# Altium schematic sheet EVK-IRIS-W1-MUCLINK.SchDoc
size A3; DocumentNumber: 7; SheetNumber: 7; SheetTotal: 14
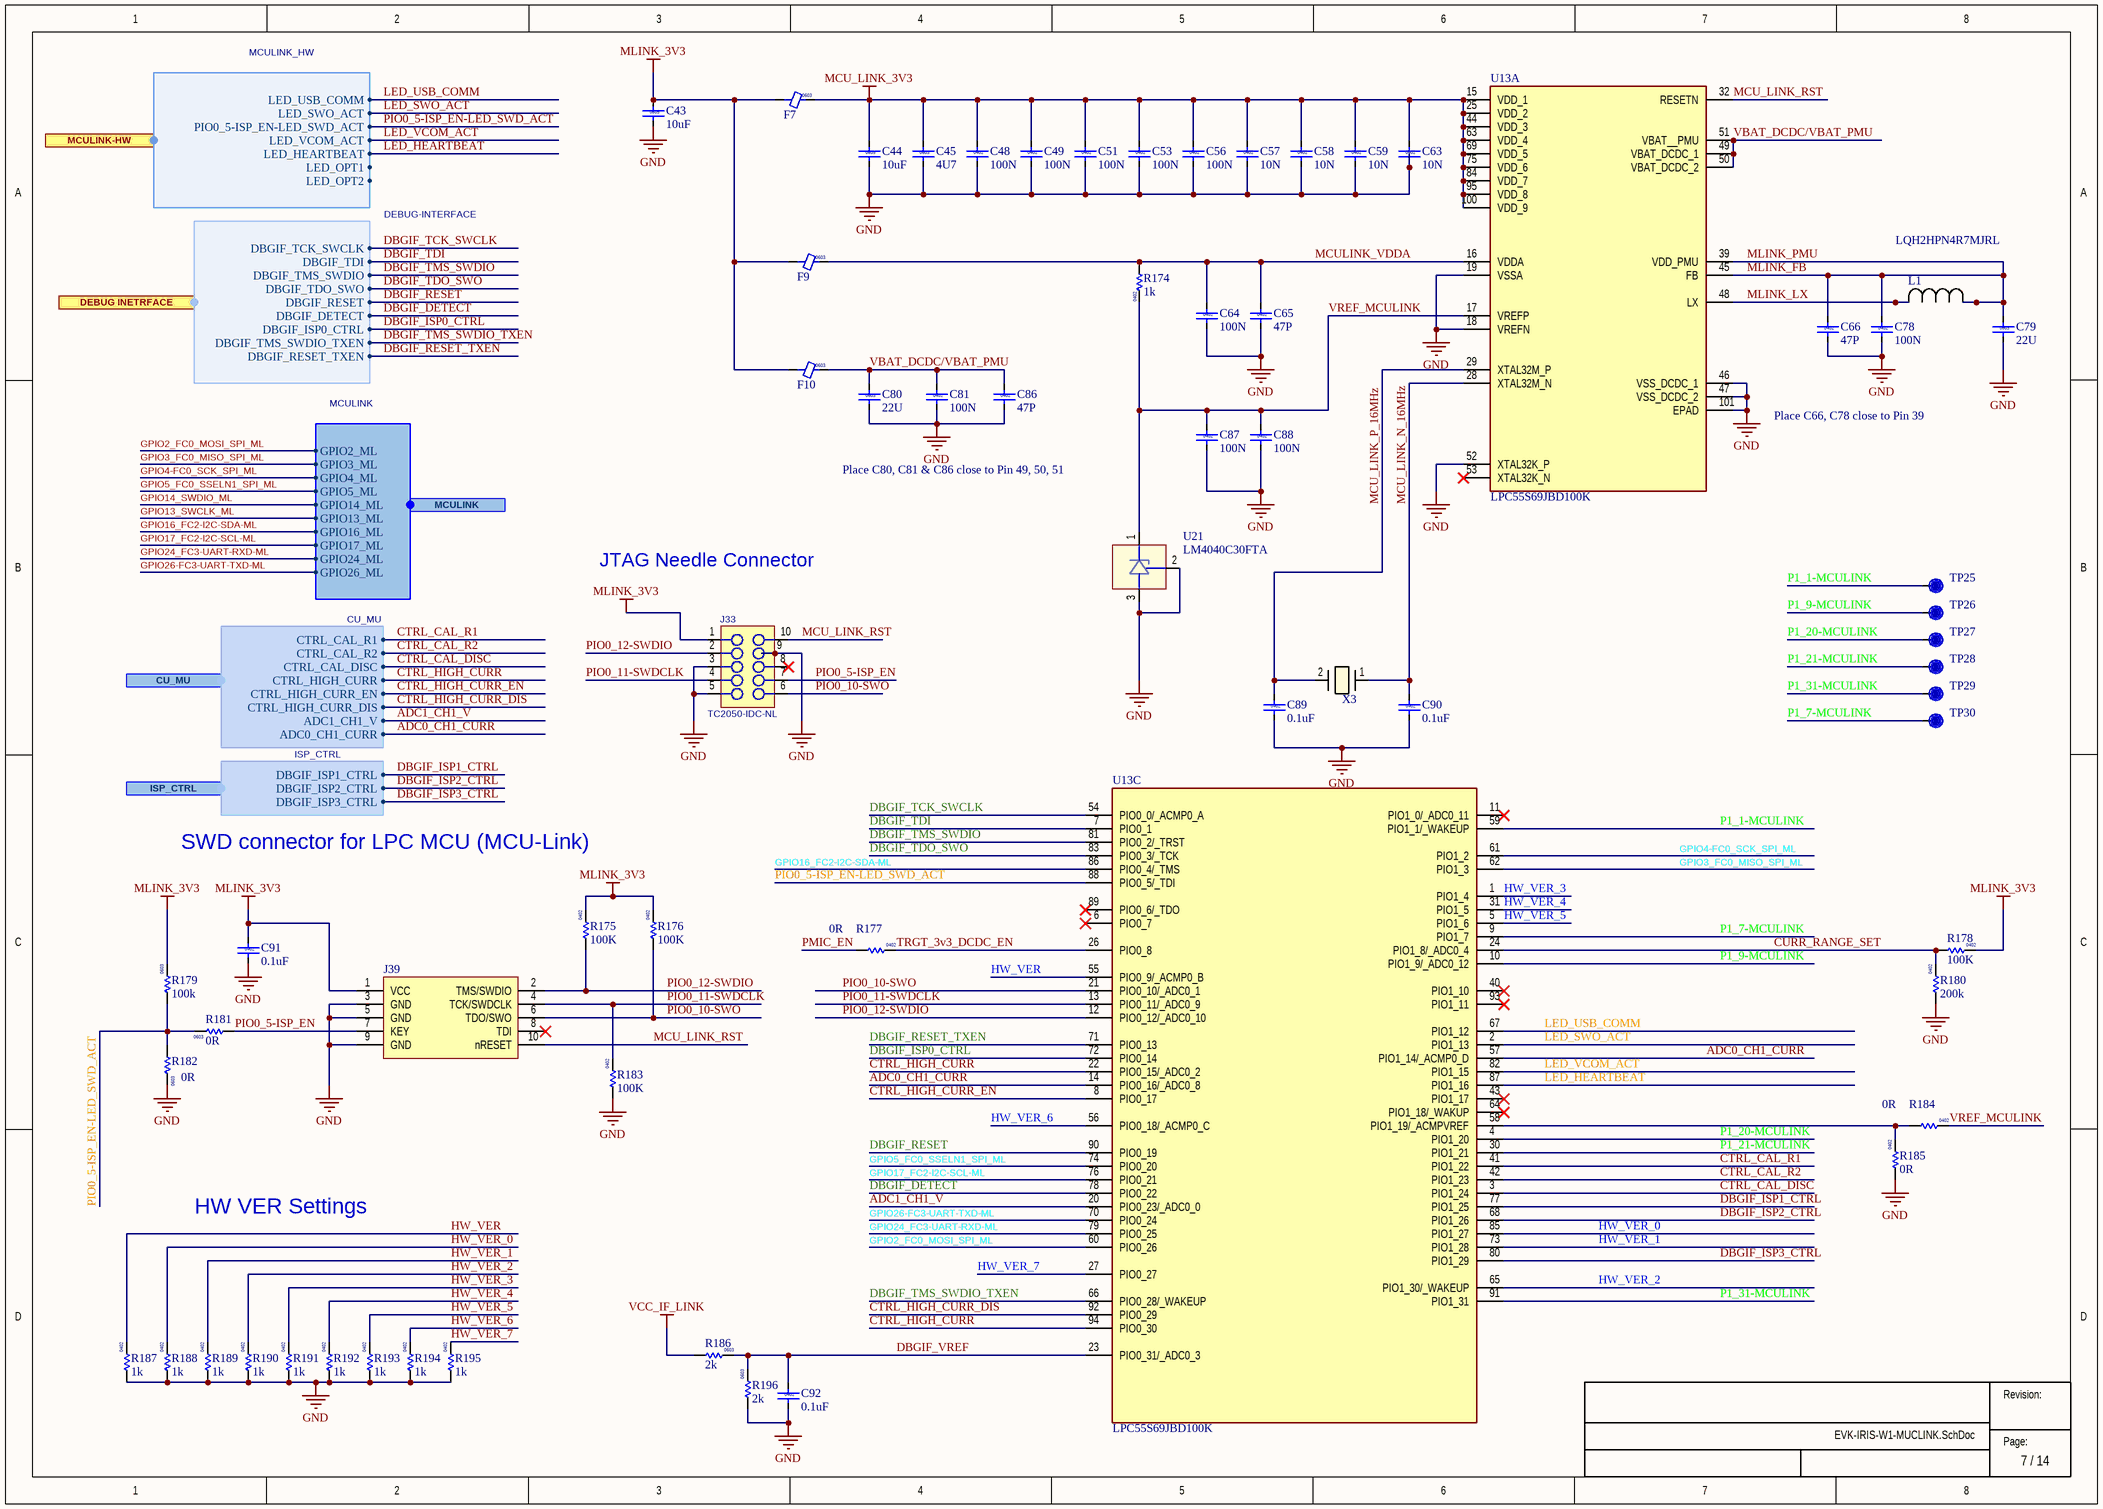
[diagram p0: EVK-IRIS-W1-MUCLINK.SchDoc]

## Parts
C43  value 10uF  Size: 0805  [Cap 0805 HD]
C44  value 10uF  Size: 0805  [Cap 0805 HD]
C45  value 4U7  Size: 0603  [Cap 0603 HD]
C48  value 100N  Size: 0402  [Cap_0402_1100Lx600Wx600H_600x600Pad_350G_FLX]
C49  value 100N  Size: 0402  [Cap_0402_1100Lx600Wx600H_600x600Pad_350G_FLX]
C51  value 100N  Size: 0402  [Cap_0402_1100Lx600Wx600H_600x600Pad_350G_FLX]
C53  value 100N  Size: 0402  [Cap_0402_1100Lx600Wx600H_600x600Pad_350G_FLX]
C56  value 100N  Size: 0402  [Cap_0402_1100Lx600Wx600H_600x600Pad_350G_FLX]
C57  value 10N  Size: 0402  [Cap_0402_1100Lx600Wx600H_600x600Pad_350G_FLX]
C58  value 10N  Size: 0402  [Cap_0402_1100Lx600Wx600H_600x600Pad_350G_FLX]
C59  value 10N  Size: 0402  [Cap_0402_1100Lx600Wx600H_600x600Pad_350G_FLX]
C63  value 10N  Size: 0402  [Cap_0402_1100Lx600Wx600H_600x600Pad_350G_FLX]
C64  value 100N  Size: 0402  [Cap_0402_1100Lx600Wx600H_600x600Pad_350G_FLX]
C65  value 47P  Size: 0402  [Cap_0402_1100Lx600Wx600H_600x600Pad_350G_FLX]
C66  value 47P  Size: 0402  [Cap_0402_1100Lx600Wx600H_600x600Pad_350G_FLX]
C78  value 100N  Size: 0402  [Cap_0402_1100Lx600Wx600H_600x600Pad_350G_FLX]
C79  value 22U  Size: 0603  [Cap 0603]
C80  value 22U  Size: 0603  [Cap 0603]
C81  value 100N  Size: 0402  [Cap_0402_1100Lx600Wx600H_600x600Pad_350G_FLX]
C86  value 47P  Size: 0402  [Cap_0402_1100Lx600Wx600H_600x600Pad_350G_FLX]
C87  value 100N  Size: 0402  [Cap_0402_1100Lx600Wx600H_600x600Pad_350G_FLX]
C88  value 100N  Size: 0402  [Cap_0402_1100Lx600Wx600H_600x600Pad_350G_FLX]
C89  value 0.1uF  Size: 0402  [Cap 0402 HD]
C90  value 0.1uF  Size: 0402  [Cap 0402 HD]
C91  value 0.1uF  Size: 0402  [Cap 0402 HD]
C92  value 0.1uF  Size: 0402  [Cap 0402 HD]
F7  Size: 0603  [IND 0603]
F9  Size: 0603  [IND 0603]
F10  Size: 0603  [IND 0603]
J33  TC2050-IDC-NLDNP  [TC2050-IDC-NL]  (value not drawn)  (no BOM)
J39  (no value)  [HDR.050P-10Pin-2x5-SMT_Key]
L1  LQH2HPN4R7MJRL  [IND_LQH2HPN4R7MJRL_MUR]
R174  value 1k  Size: 0402  [RES 0402 HD]
R175  value 100K  Size: 0402  [RES 0402 HD]
R176  value 100K  Size: 0402  [RES 0402 HD]
R177  value 0R  Size: 0402  [RES 0402 HD]
R178  value 100K  Size: 0402  [RES 0402 HD]
R179  value 100k  Size: 0603  [RES 0603 HD]
R180  value 200k  Size: 0402  [RES 0402 HD]
R181  value 0R  Size: 0603  [RES 0603 HD]
R182  value 0R  Size: 0603  [RES 0603 HD]
R183  value 100K  Size: 0402  [RES 0402 HD]
R184  value 0R  Size: 0402  [RES 0402 HD]
R185  value 0R  Size: 0402  [RES 0402 HD]
R186  value 2k  Size: 0603  [RES 0603 HD]
R187  value 1k  Size: 0402  [RES 0402 HD]
R188  value 1k  Size: 0402  [RES 0402 HD]
R189  value 1k  Size: 0402  [RES 0402 HD]
R190  value 1k  Size: 0402  [RES 0402 HD]
R191  value 1k  Size: 0402  [RES 0402 HD]
R192  value 1k  Size: 0402  [RES 0402 HD]
R193  value 1k  Size: 0402  [RES 0402 HD]
R194  value 1k  Size: 0402  [RES 0402 HD]
R195  value 1k  Size: 0402  [RES 0402 HD]
R196  value 2k  Size: 0603  [RES 0603 HD]
TP25  TP  [TP10R]  (value not drawn)
TP26  TP  [TP10R]  (value not drawn)
TP27  TP  [TP10R]  (value not drawn)
TP28  TP  [TP10R]  (value not drawn)
TP29  TP  [TP10R]  (value not drawn)
TP30  TP  [TP10R]  (value not drawn)
U13  LPC55S69JBD100K  [QFP50P1600X1600X160-101N]  (parts A,C of 3)
U21  LM4040C30FTA  [SOT-23]
X3  CX3225GA16000D0PTVCC  [xtal2_CX3225GA_AVX]  (value not drawn)

## Ports
CU_MU (harness CU_MU), DEBUG INETRFACE (harness DEBUG-INTERFACE), ISP_CTRL (harness ISP_CTRL), MCULINK (harness MCULINK), MCULINK-HW (harness MCULINK_HW)

## Harnesses
MCULINK_HW: LED_USB_COMM, LED_SWO_ACT, PIO0_5-ISP_EN-LED_SWD_ACT, LED_VCOM_ACT, LED_HEARTBEAT, LED_OPT1, LED_OPT2
DEBUG-INTERFACE: DBGIF_TCK_SWCLK, DBGIF_TDI, DBGIF_TMS_SWDIO, DBGIF_TDO_SWO, DBGIF_RESET, DBGIF_DETECT, DBGIF_ISP0_CTRL, DBGIF_TMS_SWDIO_TXEN, DBGIF_RESET_TXEN
CU_MU: CTRL_CAL_R1, CTRL_CAL_R2, CTRL_CAL_DISC, CTRL_HIGH_CURR, CTRL_HIGH_CURR_EN, CTRL_HIGH_CURR_DIS, ADC1_CH1_V, ADC0_CH1_CURR
ISP_CTRL: DBGIF_ISP1_CTRL, DBGIF_ISP2_CTRL, DBGIF_ISP3_CTRL
MCULINK: GPIO2_ML, GPIO3_ML, GPIO4_ML, GPIO5_ML, GPIO13_ML, GPIO14_ML, GPIO16_ML, GPIO17_ML, GPIO24_ML, GPIO26_ML

## Nets
GND: C43.2 C44.2 C45.2 C48.2 C49.2 C51.2 C53.2 C56.2 C57.2 C58.2 C59.2 C63.2 C64.2 C65.2 C66.2 C78.2 C79.2 C80.2 C81.2 C86.2 C87.2 C88.2 C89.2 C90.2 C91.2 C92.2 J33.3 J33.5 J33.9 J39.3(GND) J39.5(GND) J39.9(GND) R180.1 R182.2 R183.1 R185.1 R187.1 R188.1 R189.1 R190.1 R191.1 R192.1 R193.1 R194.1 R195.1 R196.1 U13.18(VREFN) U13.19(VSSA) U13.46(VSS_DCDC_1) U13.47(VSS_DCDC_2) U13.52(XTAL32K_P) U13.101(EPAD) U21.2(REF) U21.3(A)
MCU_LINK_3V3: C44.1 C45.1 C48.1 C49.1 C51.1 C53.1 C56.1 C57.1 C58.1 C59.1 C63.1 F7.2 U13.15(VDD_1) U13.25(VDD_2) U13.44(VDD_3) U13.63(VDD_4) U13.69(VDD_5) U13.75(VDD_6) U13.84(VDD_7) U13.95(VDD_8) U13.100(VDD_9)
MLINK_3V3: C43.1 C91.1 F7.1 F9.1 F10.1 J33.1 J39.1(VCC) R175.2 R176.2 R178.2 R179.2
VCC_IF_LINK: R186.1
ADC0_CH1_CURR: U13.14(PIO0_16/_ADC0_8) U13.57(PIO1_14/_ACMP0_D) ; port CU_MU.ADC0_CH1_CURR
ADC1_CH1_V: U13.20(PIO0_23/_ADC0_0) ; port CU_MU.ADC1_CH1_V
CTRL_CAL_DISC: U13.3(PIO1_24) ; port CU_MU.CTRL_CAL_DISC
CTRL_CAL_R1: U13.41(PIO1_22) ; port CU_MU.CTRL_CAL_R1
CTRL_CAL_R2: U13.42(PIO1_23) ; port CU_MU.CTRL_CAL_R2
CTRL_HIGH_CURR: U13.22(PIO0_15/_ADC0_2) U13.94(PIO0_30) ; port CU_MU.CTRL_HIGH_CURR
CTRL_HIGH_CURR_DIS: U13.92(PIO0_29) ; port CU_MU.CTRL_HIGH_CURR_DIS
CTRL_HIGH_CURR_EN: U13.8(PIO0_17) ; port CU_MU.CTRL_HIGH_CURR_EN
CURR_RANGE_SET: R178.1 R180.2 U13.24(PIO1_8/_ADC0_4)
DBGIF_DETECT: U13.78(PIO0_22) ; port DEBUG INETRFACE.DBGIF_DETECT
DBGIF_ISP0_CTRL: U13.72(PIO0_14) ; port DEBUG INETRFACE.DBGIF_ISP0_CTRL
DBGIF_ISP1_CTRL: U13.77(PIO1_25) ; port ISP_CTRL.DBGIF_ISP1_CTRL
DBGIF_ISP2_CTRL: U13.68(PIO1_26) ; port ISP_CTRL.DBGIF_ISP2_CTRL
DBGIF_ISP3_CTRL: U13.80(PIO1_29) ; port ISP_CTRL.DBGIF_ISP3_CTRL
DBGIF_RESET: U13.90(PIO0_19) ; port DEBUG INETRFACE.DBGIF_RESET
DBGIF_RESET_TXEN: U13.71(PIO0_13) ; port DEBUG INETRFACE.DBGIF_RESET_TXEN
DBGIF_TCK_SWCLK: U13.54(PIO0_0/_ACMP0_A) ; port DEBUG INETRFACE.DBGIF_TCK_SWCLK
DBGIF_TDI: U13.7(PIO0_1) ; port DEBUG INETRFACE.DBGIF_TDI
DBGIF_TDO_SWO: U13.83(PIO0_3/_TCK) ; port DEBUG INETRFACE.DBGIF_TDO_SWO
DBGIF_TMS_SWDIO: U13.81(PIO0_2/_TRST) ; port DEBUG INETRFACE.DBGIF_TMS_SWDIO
DBGIF_TMS_SWDIO_TXEN: U13.66(PIO0_28/_WAKEUP) ; port DEBUG INETRFACE.DBGIF_TMS_SWDIO_TXEN
DBGIF_VREF: C92.1 R186.2 R196.2 U13.23(PIO0_31/_ADC0_3)
GPIO2_FC0_MOSI_SPI_ML: U13.60(PIO0_26) ; port MCULINK.GPIO2_ML
GPIO3_FC0_MISO_SPI_ML: U13.62(PIO1_3) ; port MCULINK.GPIO3_ML
GPIO4-FC0_SCK_SPI_ML: U13.61(PIO1_2) ; port MCULINK.GPIO4_ML
GPIO5_FC0_SSELN1_SPI_ML: U13.74(PIO0_20) ; port MCULINK.GPIO5_ML
GPIO13_SWCLK_ML: port MCULINK.GPIO13_ML
GPIO14_SWDIO_ML: port MCULINK.GPIO14_ML
GPIO16_FC2-I2C-SDA-ML: U13.86(PIO0_4/_TMS) ; port MCULINK.GPIO16_ML
GPIO17_FC2-I2C-SCL-ML: U13.76(PIO0_21) ; port MCULINK.GPIO17_ML
GPIO24_FC3-UART-RXD-ML: U13.79(PIO0_25) ; port MCULINK.GPIO24_ML
GPIO26-FC3-UART-TXD-ML: U13.70(PIO0_24) ; port MCULINK.GPIO26_ML
HW_VER: R187.2 U13.55(PIO0_9/_ACMP0_B)
HW_VER_0: R188.2 U13.85(PIO1_27)
HW_VER_1: R189.2 U13.73(PIO1_28)
HW_VER_2: R190.2 U13.65(PIO1_30/_WAKEUP)
HW_VER_3: R191.2 U13.1(PIO1_4)
HW_VER_4: R192.2 U13.31(PIO1_5)
HW_VER_5: R193.2 U13.5(PIO1_6)
HW_VER_6: R194.2 U13.56(PIO0_18/_ACMP0_C)
HW_VER_7: R195.2 U13.27(PIO0_27)
LED_HEARTBEAT: U13.87(PIO1_16) ; port MCULINK-HW.LED_HEARTBEAT
LED_SWO_ACT: U13.2(PIO1_13) ; port MCULINK-HW.LED_SWO_ACT
LED_USB_COMM: U13.67(PIO1_12) ; port MCULINK-HW.LED_USB_COMM
LED_VCOM_ACT: U13.82(PIO1_15) ; port MCULINK-HW.LED_VCOM_ACT
MCU_LINK_N_16MHz: C90.1 U13.28(XTAL32M_N) X3.1
MCU_LINK_P_16MHz: C89.1 U13.29(XTAL32M_P) X3.2
MCU_LINK_RST: J33.10 J39.10(nRESET) U13.32(RESETN)
MCULINK_VDDA: C64.1 C65.1 F9.2 R174.2 U13.16(VDDA)
MLINK_FB: C66.1 C78.1 C79.1 L1.1 U13.39(VDD_PMU) U13.45(FB)  [also labelled MLINK_PMU]
MLINK_LX: L1.2 U13.48(LX)
P1_1-MCULINK: TP25.1 U13.59(PIO1_1/_WAKEUP)
P1_7-MCULINK: TP30.1 U13.9(PIO1_7)
P1_9-MCULINK: TP26.1 U13.10(PIO1_9/_ADC0_12)
P1_20-MCULINK: TP27.1 U13.4(PIO1_20)
P1_21-MCULINK: TP28.1 U13.30(PIO1_21)
P1_31-MCULINK: TP29.1 U13.91(PIO1_31)
PIO0_5-ISP_EN: J33.7 J39.7(KEY) R181.1
PIO0_5-ISP_EN-LED_SWD_ACT: R179.1 R181.2 R182.1 U13.88(PIO0_5/_TDI) ; port MCULINK-HW.PIO0_5-ISP_EN-LED_SWD_ACT
PIO0_10-SWO: J33.6 J39.6(TDO/SWO) R176.1 U13.21(PIO0_10/_ADC0_1)
PIO0_11-SWDCLK: J33.4 J39.4(TCK/SWDCLK) R183.2 U13.13(PIO0_11/_ADC0_9)
PIO0_12-SWDIO: J33.2 J39.2(TMS/SWDIO) R175.1 U13.12(PIO0_12/_ADC0_10)
PMIC_EN: R177.1
TRGT_3v3_DCDC_EN: R177.2 U13.26(PIO0_8)
VBAT_DCDC/VBAT_PMU: C80.1 C81.1 C86.1 F10.2 U13.49(VBAT_DCDC_1) U13.50(VBAT_DCDC_2) U13.51(VBAT__PMU)
VREF_MCULINK: C87.1 C88.1 R174.1 R184.2 U13.17(VREFP) U21.1(C)
NetR184_1: R184.1 R185.2 U13.58(PIO1_19/_ACMPVREF)

Not connected (* = marked no-connect by the designer): J33 8*; J39 8(TDI)*; U13 6(PIO0_7)* 11(PIO1_0/_ADC0_11)* 40(PIO1_10)* 43(PIO1_17)* 53(XTAL32K_N)* 64(PIO1_18/_WAKUP)* 89(PIO0_6/_TDO)* 93(PIO1_11)*

## Notes on the sheet
- Place C66, C78 close to Pin 39
- Place C80, C81 & C86 close to Pin 49, 50, 51
- JTAG Needle Connector
- SWD connector for LPC MCU (MCU-Link)
- HW VER Settings
- Revision:
- Page:

## Library data of the parts
C43 C44 = 120-00129: CAP CER 10uF 25V 10% X5R 0805; Manufacturer 1: Samsung Electro-Mechanics America, Inc.; Manufacturer Part Number 1: CL21A106KAYNNNE; Item Phase: Unreleased; Tolerance: +/- 10%; Use in new designs: Yes; UBX Code: None; Part Number: 120-00129; Supplier 1: Digi-Key; Supplier Part Number 1: 1276-2891-1-ND; Manufacturer 2: Murata Electronics North America; Manufacturer Part Number 2: GRM21BR61E106KA73L; Supplier 2: Digi-Key; Supplier Part Number 2: 490-5523-1-ND; Height: 1.45mm; Max Operating Temp: 85; Min Operating Temp: -55; Part Name: CAP CER 10uF 25V 10% X5R 0805; Pins: 2; Revision: None; Temperature Coefficient: X5R; Voltage: 25V
C45 = UBXH01-0000278: CAP CER X6S 0603 AUTOMOTIVE 4U7 10%; Manufacturer: Murata Manufacturing Company, Ltd.; Manufacturer P/N: GRM188C80J475KE15; Editor: philippe.largier; Released by: alvaro.nussbaum; Env: GREEN; Permitted Use: Volume Products; Perferred: PREF; Mfg P/N Status: NRND; Mfg P/N Split: 100; Mfg P/N Released: Yes; Part Number: UBXH01-0000278; Tolerance: 10%; Min Operating Temp: -40°C; Max Operating Temp: 105°C; Part Type: Capacitor; Release Data: 2017-09-22T08:58:54; UBX Wiki: https://wiki.u-blox.com/bin/view/Operations/PartDetails?index=25459; RefDes: C; Mfg P/N Datasheet: https://wiki.u-blox.com/bin/view/Generic/Docs/DocumentSummary?index=25460; Manufacturer 2: TDK Corporation; Manufacturer P/N 2: C1608X7S0J475K080AC; Mfg P/N Status 2: NRND; Mfg P/N Split 2: 0; Mfg P/N Released 2: Yes; Mfg P/N Datasheet 2: https://wiki.u-blox.com/bin/view/Generic/Docs/DocumentSummary?index=28284; Manufacturer 3: Murata Manufacturing Company, Ltd.; Manufacturer P/N 3: GRT188C80J475KE01; Mfg P/N Status 3: NRND; Mfg P/N Split 3: 0; Mfg P/N Released 3: Yes; Mfg P/N Datasheet 3: https://wiki.u-blox.com/bin/view/Generic/Docs/DocumentSummary?index=28287
C48 C49 C51 C53 C56 C64 C78 C81 C87 C88 = UBXH01-0000233: CAP CER X7R 0402 100N 10% 16V; Manufacturer: Murata Manufacturing Company, Ltd.; Manufacturer P/N: GRM155R71C104KA88D; Editor: philippe.largier; Released by: charlotte.biber; Env: ROHS; Permitted Use: Volume Products; Perferred: PREF; Mfg P/N Status: NRND; Mfg P/N Split: 100; Mfg P/N Released: Yes; Part Number: UBXH01-0000233; Tolerance: 10%; Max Voltage: 16V; Min Operating Temp: -55°C; Max Operating Temp: 125°C; Part Type: Capacitor; Release Data: 2016-10-06T14:40:00; UBX Wiki: https://wiki.u-blox.com/bin/view/Operations/PartDetails?index=24094; RefDes: C
C57-C59 C63 = UBXH01-0023025: CAP CER X7R 0402 10N 10% 16V; Manufacturer: Murata Manufacturing Company, Ltd.; Manufacturer P/N: GRM155R71C103KA01; Editor: roland.rust; Released by: anthony.gergis; Env: ROHS; Permitted Use: Volume Products; Perferred: PREF; Mfg P/N Status: NRND; Mfg P/N Split: 100; Mfg P/N Released: Yes; Part Number: UBXH01-0023025; Manufacturer 2: Samsung Electro-Mechanics; Max Operating Temp: 125°C; Min Operating Temp: -55°C; Tolerance: 10%; Max Voltage: 16V; Part Type: Capacitor; Release Data: 2021-02-16T13:14:11; UBX Wiki: https://wiki.u-blox.com/bin/view/Operations/PartDetails?index=5491; RefDes: C; Manufacturer P/N 2: CL05B103KO5NNNC; Mfg P/N Status 2: Active; Mfg P/N Split 2: 0; Mfg P/N Released 2: Yes; Mfg P/N Datasheet 2: https://wiki.u-blox.com/bin/view/Generic/Docs/DocumentSummary?index=28567
C65 C66 C86 = UBXH01-0008022: CAP CER C0G 0402 47P 10% 25V; Manufacturer: Murata Manufacturing Company, Ltd.; Manufacturer P/N: GRM1555C1E470KZ01; Editor: andreas.thiel; Env: ROHS; Permitted Use: Volume Products; Perferred: NONPREF; Mfg P/N Status: Obsolete; Mfg P/N Split: 0; Mfg P/N Released: No; Part Number: UBXH01-0008022; Tolerance: 10%; Max Voltage: 25V; Part Type: Capacitor; UBX Wiki: https://wiki.u-blox.com/bin/view/Operations/PartDetails?index=5404; RefDes: C; Manufacturer 2: Murata Manufacturing Company, Ltd.; Manufacturer P/N 2: GRM1555C1H470KZ01; Mfg P/N Status 2: Obsolete; Mfg P/N Split 2: 0; Mfg P/N Released 2: No; Manufacturer 3: Murata Manufacturing Company, Ltd.; Manufacturer P/N 3: GRM1555C1E470JZ01; Mfg P/N Status 3: Obsolete; Mfg P/N Split 3: 0; Mfg P/N Released 3: No
C79 C80 = UBXH01-0000150: CAP CER X5R 0603 22U 20% 10V; Manufacturer: Murata Manufacturing Company, Ltd.; Manufacturer P/N: GRM188R61A226ME15D; Editor: dario.antonaz; Released by: pasquale.scorca; Env: ROHS; Permitted Use: Volume Products; Perferred: PREF; Mfg P/N Status: Active; Mfg P/N Split: 100; Mfg P/N Released: Yes; Part Number: UBXH01-0000150; Tolerance: 20%; Max Voltage: 10V; Part Type: Capacitor; Release Data: 2016-03-09T11:21:55; UBX Wiki: https://wiki.u-blox.com/bin/view/Operations/PartDetails?index=21275; RefDes: C; Mfg P/N Datasheet: https://wiki.u-blox.com/bin/view/Generic/Docs/DocumentSummary?index=21277
C89-C92 = 120-00016: Cap, Ceramic 0.1uF 10V 10% X5R 0402; Manufacturer 1: Murata Electronics North America; Manufacturer Part Number 1: GRM155R61A104KA01J; Part Name: CAP CER 0.1UF 10V 10% X5R 0402; Item Phase: In Production; Tolerance: +/- 10%; Use in new designs: Yes; UBX Code: None; Part Number: 120-00016; Supplier 1: Digi-Key; Supplier Part Number 1: 490-6297-1-ND; Manufacturer 2: Yageo; Manufacturer Part Number 2: CC0402KRX5R6BB104; Supplier 2: Digi-Key; Supplier Part Number 2: 311-1336-1-ND; Height: 0.55mm; Max Operating Temp: 85; Min Operating Temp: -55; Pins: 2; Revision: 0A; Temperature Coefficient: X5R; Voltage: 10V
F7 F9 F10 = UBXH08-0041002: FERRITE BEAD MURATA BLM18HD 0603 600R@100MHZ; Manufacturer: Murata Manufacturing Company, Ltd.; Manufacturer P/N: BLM18HD601SN1; Editor: roland.rust; Env: ROHS; Permitted Use: Volume Products; Perferred: PREF; Mfg P/N Status: Active; Mfg P/N Split: 100; Mfg P/N Released: Yes; Part Number: UBXH08-0041002; Value: 600R@100MHZ; Part Type: Ferrite; Released by: roland.rust; Release Data: 2005-07-22T13:59:44; UBX Wiki: https://wiki.u-blox.com/bin/view/Operations/PartDetails?index=7112; RefDes: FB
J33 = TC2050-IDC-NL: CON PADS FOR CBL PLUG-OF-NAILS 10-PIN NO LEGS; Manufacturer: TAG Connect; Added By: Paul B; Manufacturer P/N: TC2050-IDC-NL; Part Number: TC2050-IDC-NL; Size: 6.1mm x 9.9mm; Height: 0; DNP: DNP; Added Date: 12/3/2015
J39 = 130-00099: Header 0.05" 10Pin 2Row SMD Black; Part Name: CON HDR 0.05" 10Pin 2Row SMD Black; Manufacturer 1: Samtec; Manufacturer Part Number 1: FTSH-105-01-F-DV-K; Use in new designs: Yes; UBX Code: None; Item Phase: In Production; Part Number: 130-00099; Revision: 0A; Supplier 1: Digi-Key; Supplier Part Number 1: SAM8796-ND; Height: 6mm; Pins: 10; Manufacturer 2: None; Max Operating Temp: 125; Supplier 2: None; Supplier Part Number 2: None; Voltage: None; Diameter: None; Min Operating Temp: -55; Manufacturer Part Number 2: None
L1 = LQH2HPN4R7MJRL: No Description Available; Mfr_Name: Murata; Type: DEV; Copyright: Copyright (C) 2023 Ultra Librarian. All rights reserved.; Manufacturer_Part_Number: LQH2HPN4R7MJRL; RefDes: RefDes
R174 R187-R195 = 180-00021: Resistor 1k ohm 1% 1/16W, 0402; Manufacturer 1: Hong Kong Resistors Manufactory; Manufacturer Part Number 1: RCT021KFLF; Part Name: RES SMD 1K OHM 1% 1/16W 0402; Item Phase: In Production; Tolerance: +/- 1%; Use in new designs: Yes; Voltage: None; Part Number: 180-00021; Supplier 1: None; Supplier Part Number 1: None; Manufacturer 2: Yageo; Manufacturer Part Number 2: RC0402FR-071KL; Supplier 2: Digi-Key; Supplier Part Number 2: 311-1.00KLRCT-ND; Height: 0.4mm; Max Operating Temp: 155; Min Operating Temp: -55; Pins: 2; Power: 1/16W; Revision: 0E; UBX Code: None
R175 R176 R178 R183 = UBXH18-0000005: RES THICK FILM CHIP 0402 100K 1% 63mW; Manufacturer: KOA; Manufacturer P/N: RK73H1ETTP1003F; Editor: dario.antonaz; Released by: sandro.sestan; Env: ROHS; Permitted Use: Volume Products; Mfg P/N Status: Active; Mfg P/N Split: 100; Mfg P/N Released: Yes; Part Number: UBXH18-0000005; Manufacturer 2: ROHM; Tolerance: 1%; Max Power: 63mW; Part Type: Resistor; Release Data: 2009-11-30T11:05:22; UBX Wiki: https://wiki.u-blox.com/bin/view/Operations/PartDetails?index=8114; Perferred: N/A; RefDes: R; Mfg P/N Datasheet: https://wiki.u-blox.com/bin/view/Generic/Docs/DocumentSummary?index=8222; Manufacturer P/N 2: MCR01MZPF1003; Mfg P/N Status 2: Active; Mfg P/N Split 2: 0; Mfg P/N Released 2: Yes; Mfg P/N Datasheet 2: https://wiki.u-blox.com/bin/view/Generic/Docs/DocumentSummary?index=8186
R177 R184 R185 = UBXH18-0003002: RES THICK FILM CHIP 0402 0R 0 100mW; Manufacturer: KOA; Manufacturer P/N: RK73Z1ETTD; Tolerance: 0; Editor: charlotte.biber; Released by: peter.mueller; Env: ROHS; Permitted Use: Volume Products; Perferred: PREF; Mfg P/N Status: NRND; Mfg P/N Split: 100; Mfg P/N Released: Yes; Part Number: UBXH18-0003002; Manufacturer 2: YAGEO; Max Power: 100mW; Part Type: Resistor; Release Data: 2012-06-05T09:49:55; UBX Wiki: https://wiki.u-blox.com/bin/view/Operations/PartDetails?index=6611; RefDes: R; Manufacturer P/N 2: 2322_705_91001_L; Mfg P/N Status 2: NRND; Mfg P/N Split 2: 0; Mfg P/N Released 2: Yes
R179 = 180-00014: Resistor, 100k ohm 1% 1/10W, 0603; Manufacturer 1: Samsung Electro-Mechanics America, Inc; Manufacturer Part Number 1: RC1608F104CS; Part Name: RES SMD 100K OHM 1% 1/10W 0603; Item Phase: In Production; Tolerance: +/- 1%; Use in new designs: Yes; Voltage: None; Part Number: 180-00014; Supplier 1: Digi-Key; Supplier Part Number 1: 1276-3486-1-ND; Manufacturer 2: Rohm Semiconductor; Manufacturer Part Number 2: MCR03ERTF1003; Supplier 2: Digi-Key; Supplier Part Number 2: RHM100KCFCT-ND; Height: 0.55mm; Max Operating Temp: 155; Min Operating Temp: -55; Pins: 2; Power: 1/10W; Revision: 0A; UBX Code: None
R180 = 180-00055: Resistor 200k ohm 1%, 1/16W, 0402; Manufacturer 1: Rohm Semiconductor; Manufacturer Part Number 1: MCR01MRTF2003; Part Name: RES SMD 200K OHM 1% 1/16W 0402; Item Phase: In Production; Tolerance: +/- 1%; Use in new designs: Yes; Voltage: None; Part Number: 180-00055; Supplier 1: Digi-Key; Supplier Part Number 1: RHM200KCDCT-ND; Manufacturer 2: Samsung Electro-Mechanics America, Inc; Manufacturer Part Number 2: RC1005F204CS; Supplier 2: Digi-Key; Supplier Part Number 2: 1276-3449-1-ND; Height: 0.4mm; Max Operating Temp: 155; Min Operating Temp: -55; Pins: 2; Power: 1/16W; Revision: 0A; UBX Code: None
R181 = UBXH18-0003001: RES THICK FILM CHIP 0603 0R 0 100mW; Manufacturer: YAGEO; Manufacturer P/N: RC0603JR-070RL; Tolerance: 0; Editor: martin.frauchiger; Env: ROHS; Permitted Use: Volume Products; Perferred: PREF; Mfg P/N Status: Active; Mfg P/N Split: 100; Mfg P/N Released: Yes; Part Number: UBXH18-0003001; Max Power: 100mW; Part Type: Resistor; Released by: martin.frauchiger; Release Data: 2005-07-14T10:55:51; UBX Wiki: https://wiki.u-blox.com/bin/view/Operations/PartDetails?index=6609; RefDes: R
R182 = 180-00012: Resistor 0 ohm Jumper, 1/10W, 0603; Manufacturer 1: Hong Kong Resistors Manufactory; Manufacturer Part Number 1: RCT030RLF; Part Name: RES SMD 0.0 OHM JUMPER 1/10W 0603; Item Phase: In Production; Tolerance: None; Use in new designs: Yes; Part Number: 180-00012; Supplier 1: None; Supplier Part Number 1: None; Manufacturer 2: Samsung Electro-Mechanics America, Inc; Manufacturer Part Number 2: RC1608J000CS; Supplier 2: Digi-Key; Supplier Part Number 2: 1276-3510-1-ND; Height: 0.55mm; Max Operating Temp: 155; Min Operating Temp: -55; Pins: 2; Power: 1/10W; Revision: 0D; Voltage: None; UBX Code: None
R186 R196 = 180-00037: Resistor 2k ohm 1% 1/10W, 0603.; Manufacturer 1: Samsung Electro-Mechanics America, Inc; Manufacturer Part Number 1: RC1608F202CS; Part Name: RES SMD 2K OHM 1% 1/10W 0603; Item Phase: In Production; Tolerance: +/- 1%; Use in new designs: Yes; Voltage: None; Part Number: 180-00037; Supplier 1: Digi-Key; Supplier Part Number 1: 1276-3495-1-ND; Manufacturer 2: Rohm Semiconductor; Manufacturer Part Number 2: MCR03ERTF2001; Supplier 2: Digi-Key; Supplier Part Number 2: RHM2.00KCFCT-ND; Height: 0.55mm; Max Operating Temp: 155; Min Operating Temp: -55; Pins: 2; Power: 1/10W; Revision: 0A; UBX Code: None
TP25-TP30 = TP10R: Testpoint, Round 1.0mm Dia; Added By: Jeremy D; Part Number: TP10R; Size: 1.0mm; Height: 0; DNP: DNP; Added Date: 2015-02-01; Checked By: Paul B; Checked Date: 2015-02-05
U13 = LPC55S69JBD100K: NXP - LPC55S69JBD100K - MCU, 32BIT, 100MHZ, HLQFP; Geometry.Height: 1.6mm; Manufacturer_Name: NXP; Manufacturer_Part_Number: LPC55S69JBD100K; Mouser Part Number: 771-LPC55S69JBD100K; Mouser Price/Stock: https://www.mouser.co.uk/ProductDetail/NXP-Semiconductors/LPC55S69JBD100K?qs=0lSvoLzn4L8rE5nEAmBIGw%3D%3D; Arrow Part Number: LPC55S69JBD100K; Arrow Price/Stock: https://www.arrow.com/en/products/lpc55s69jbd100k/nxp-semiconductors?region=nac; Datasheet Link: https://au.mouser.com/datasheet/2/302/LPC55S6x-1536969.pdf
U21 = LM4040C30FTA: Shunt Voltage Reference IC Fixed 3V V ±0.5% 15 mA SOT-23-3
X3 = CX3225GA16000D0PTVCC: No Description Available; Mfr_Name: KYOCERA AVX; Copyright: Copyright (C) 2023 Ultra Librarian. All rights reserved.; Manufacturer_Part_Number: CX3225GA16000D0PTVCC; RefDes: RefDes; Type: DEV